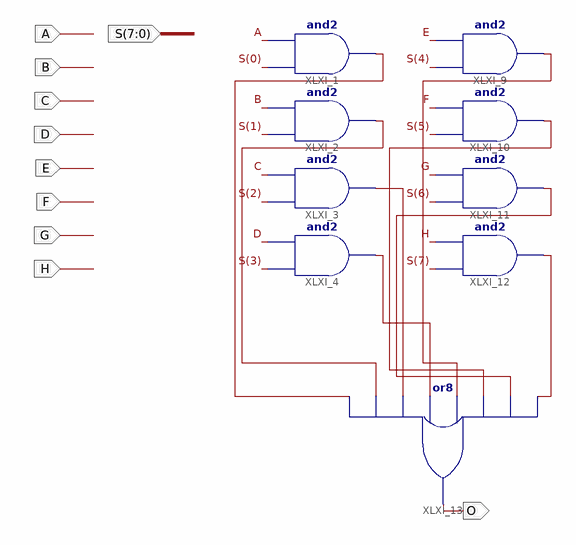
[diagram p0: schematic sheet 1]
// Xilinx ISE schematic mux8b1.sch (spartan3e) as structural Verilog: 9 symbols, 10 ports
module mux8b1 (
  input  A,
  input  B,
  input  C,
  input  D,
  input  E,
  input  F,
  input  G,
  input  H,
  input  [7:0] S,
  output O
);

  wire XLXN_27, XLXN_30, XLXN_54, XLXN_55, XLXN_56, XLXN_58, XLXN_59, XLXN_60;

  and XLXI_1 (XLXN_55, S[0], A);
  and XLXI_2 (XLXN_56, S[1], B);
  and XLXI_3 (XLXN_27, S[2], C);
  and XLXI_4 (XLXN_30, S[3], D);
  and XLXI_9 (XLXN_58, S[4], E);
  and XLXI_10 (XLXN_59, S[5], F);
  and XLXI_11 (XLXN_60, S[6], G);
  and XLXI_12 (XLXN_54, S[7], H);
  or XLXI_13 (O, XLXN_55, XLXN_56, XLXN_27, XLXN_30, XLXN_58, XLXN_59, XLXN_60, XLXN_54);
endmodule
